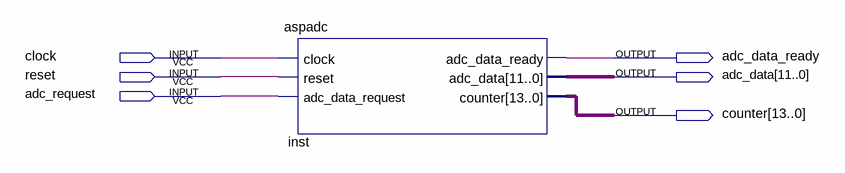
[diagram p0: schematic sheet]
// Quartus schematic toplevel.bdf as structural Verilog: 1 symbols, 6 pins
module toplevel (
  input  clock,
  input  reset,
  input  adc_request,
  output adc_data_ready,
  output [11:0] adc_data,
  output [13:0] counter
);

  aspadc inst (
    .clock(clock), .reset(reset), .adc_data_request(adc_request), .adc_data_ready(adc_data_ready),
    .adc_data(adc_data), .counter(counter));
endmodule
